# Altium schematic sheet LM61495Q3_PINOUT.SchDoc
size A4; SheetNumber: 6; SheetTotal: 7
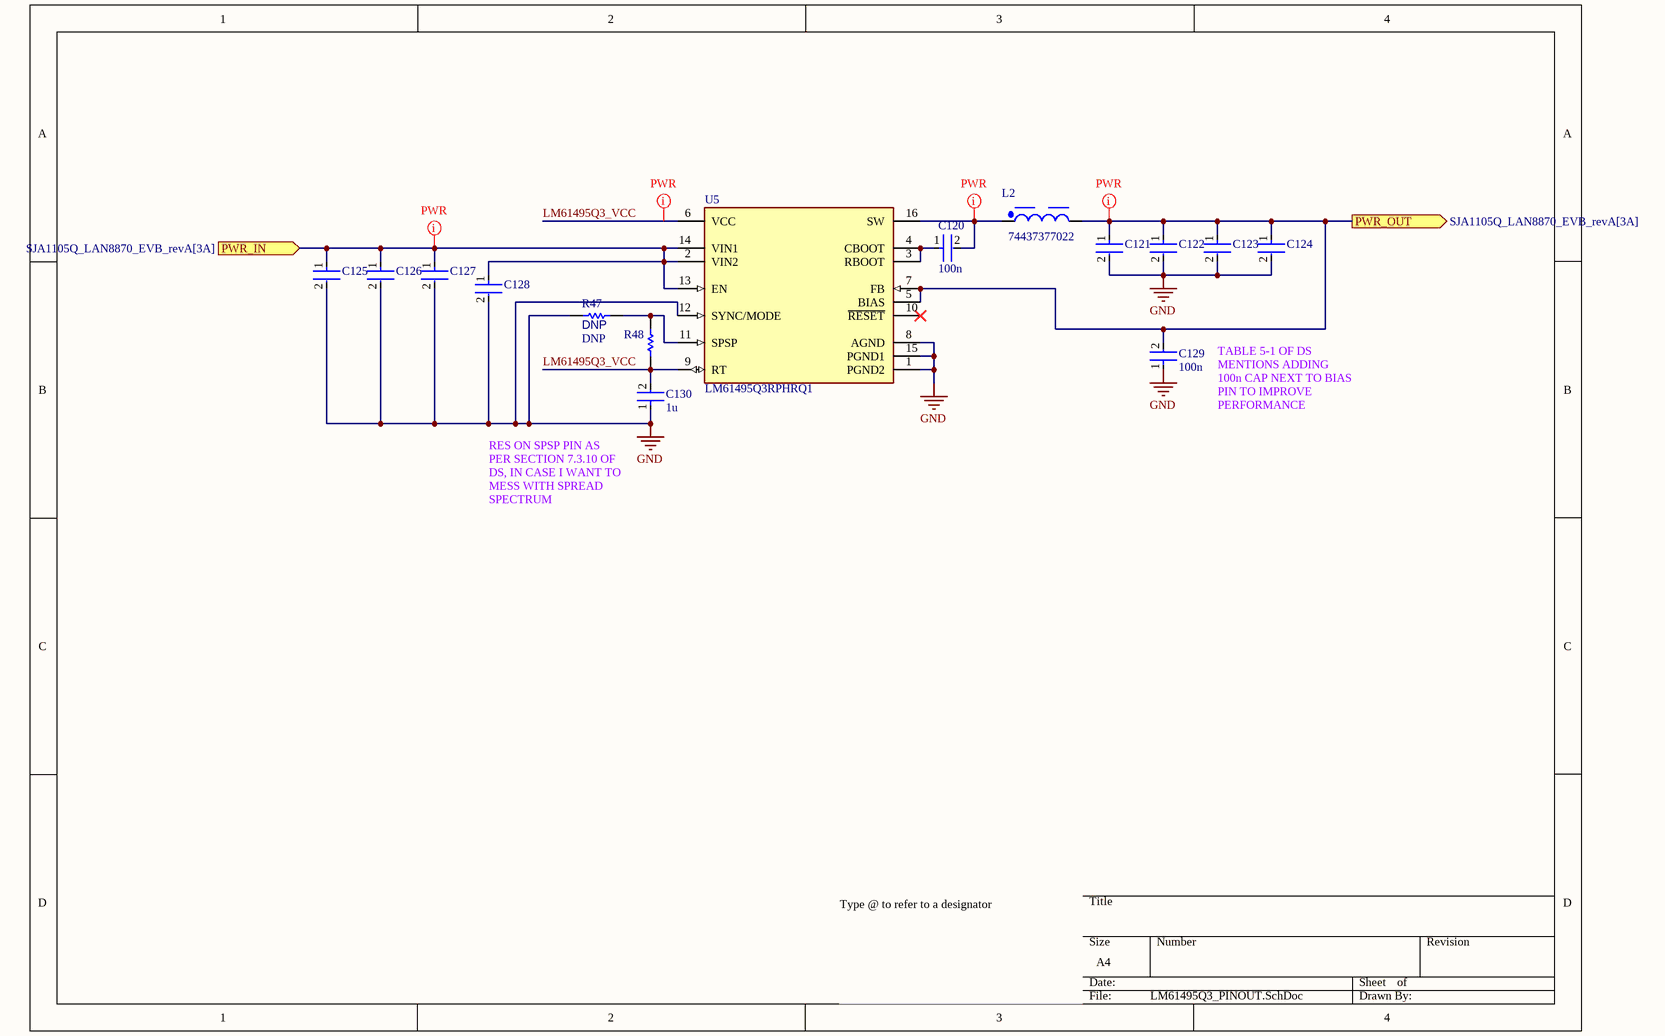
[diagram p0: LM61495Q3_PINOUT.SchDoc]

## Parts
C120  100n  [FP-0402-L_1_0_0_05-W_0_5-IPC_A]
C121  GRM32ER61C476KE15L  [FP-GRM32E-0_3-0_2-IPC_C]  (value not drawn)
C122  GRM32ER61C476KE15L  [FP-GRM32E-0_3-0_2-IPC_C]  (value not drawn)
C123  GRM32ER61C476KE15L  [FP-GRM32E-0_3-0_2-IPC_C]  (value not drawn)
C124  DNP  [FP-GRM32E-0_3-0_2-IPC_C]  (value not drawn)
C125  C3225X7R1H106M250AC  [FP-C3225-250-0_4-MFG]  (value not drawn)
C126  C3225X7R1H106M250AC  [FP-C3225-250-0_4-MFG]  (value not drawn)
C127  08055C474J4Z2A  [FP-0805-L_2_01_0_2-W_1_25-IPC_B]  (value not drawn)
C128  08055C474J4Z2A  [FP-0805-L_2_01_0_2-W_1_25-IPC_B]  (value not drawn)
C129  100n  [FP-0402-L_1_0_0_05-W_0_5-IPC_A]
C130  1u  [FP-0402-L_1_0_0_05-W_0_5-IPC_A]
L2  74437377022  [WE-LHMI_1335]
R47  DNP  [R0603B]
R48  0402 JUMPER  [RESC1005X40X25ML05T05]  (value not drawn)
U5  LM61495Q3RPHRQ1  [FP-RPH0016A-MFG]

## Ports
PWR_IN (in, see SJA1105Q_LAN8870_EVB_revA[3A]), PWR_OUT (out, see SJA1105Q_LAN8870_EVB_revA[3A])

## Nets
GND: C121.2 C122.2 C123.2 C124.2 C125.2 C126.2 C127.2 C128.2 C129.1 C130.1 R47.2 U5.1(PGND2) U5.8(AGND) U5.12(SYNC/MODE) U5.15(PGND1)
LM61495Q3_VCC: C130.2 R48.1 U5.6(VCC) U5.9(RT)
PWR_IN: C125.1 C126.1 C127.1 C128.1 U5.2(VIN2) U5.13(EN) U5.14(VIN1) ; port PWR_IN
PWR_OUT: C121.1 C122.1 C123.1 C124.1 C129.2 L2.2 U5.5(BIAS) U5.7(FB) ; port PWR_OUT
NetC120_1: C120.1 U5.3(RBOOT) U5.4(CBOOT)
NetC120_2: C120.2 L2.1 U5.16(SW)
NetR47_1: R47.1 R48.2 U5.11(SPSP)

Not connected (* = marked no-connect by the designer): U5 10(~{RESET})*

## Layout directives
net class PWR: LM61495Q3_VCC, NetC120_2, PWR_IN, PWR_OUT

## Notes on the sheet
- TABLE 5-1 OF DS MENTIONS ADDING 100n CAP NEXT TO BIAS PIN TO IMPROVE PERFORMANCE
- (near C130) RES ON SPSP PIN AS PER SECTION 7.3.10 OF DS, IN CASE I WANT TO MESS WITH SPREAD SPECTRUM
- Type @ to refer to a designator

## Library data of the parts
C120 C129 C130 = CMP-001-00058-1: LARGE PADS, 0402 CAP, CHANGE COMMENT TO MATCH REAL P/N; Capacitor Type: Ceramic; Min Operating Temperature: -55°C; Mounting Technology: Surface Mount; Pins: 2; Case/Package: 0402; RoHS Compliant: Yes; Max Operating Temperature: 85°C
C121-C124 = CMP-2000-06362-2: CAP CER 47UF 16V X5R 1210; Tolerance: 10%; Material: Ceramic; Case Code (Metric): 3225; RoHS Compliant: Yes; Min Operating Temperature: -55°C; Radiation Hardening: No; Voltage: 16V; Package Quantity: 1; Case Code (Imperial): 1210; REACH SVHC: No SVHC; Capacitance: 47uF; Voltage Rating (DC): 16V; Dielectric: X5R; Case/Package: 1210; Length: 3.2mm; Voltage Rating: 16V; Packaging: Cut Tape; Width: 0.098inch; Number of Pins: 2; Lead Free: Lead Free; Height: 2.5mm; Mount: Surface Mount; Termination: SMD/SMT; Max Operating Temperature: 85°C; Thickness: 0.106inch; Depth: 2.5mm
C125 C126 = CMP-08246-002653-1: Multilayer Ceramic Capacitors 10uF ±20% 50V X7R SMD 1210; Width: 0.098inch; Package Quantity: 1000; Height: 2.5mm; Dielectric Material: Ceramic; Voltage Rating: 50V; Series: C; Capacitance: 10uF; Tolerance: 20%; Weight: 0.000564oz; Case/Package: 1210; Case Code (Imperial): 1210; Dielectric: X7R; Case Code (Metric): 3225; REACH SVHC: No SVHC; Packaging: Tape and Reel; Length: 0.126inch; Termination: SMD/SMT; Min Operating Temperature: -55°C; Voltage Rating (DC): 50V; Lead Free: Lead Free; Max Operating Temperature: 125°C; Thickness: 0.11inch; Mount: Surface Mount
C127 C128 = CMP-04427-003155-1: Automotive Ceramic Capacitor, 0805, 470nF, 5%, X7R, 15%, 50V; Dielectric: X7R; Depth: 1.25mm; Max Operating Temperature: 125°C; Mount: Surface Mount; Radiation Hardening: No; Capacitance: 470nF; Construction: Flat; Packaging: Tape and Reel; Min Operating Temperature: -55°C; Length: 2.01mm; RoHS Compliant: Yes; Voltage Rating (DC): 50V; Case/Package: 0805; Tolerance: 5%; Package Quantity: 2000
L2 = CMP-1353-00019-6: Inductor Power Shielded/Molded Wirewound 2.2uH 20% 100KHz Powdered Iron 10A 0.008Ohm DCR T/R Automotive AEC-Q200; Series Resistance: 8mΩ; DC Resistance (DCR): 7.2mΩ; Inductance: 2.2µH; Saturation Current: 14.2A; Core Material: Composite, Ferrite; Frequency: 22MHz; Mount: Surface Mount; Ambient Temperature Range Low: -40°C; Max DC Current: 10A; Depth: 12.6mm; Height: 3.3mm; Tolerance: 20%; REACH SVHC: Unknown; Width: 12.6mm; Max Operating Temperature: 125°C; Height - Seated (Max): 3.5052mm; Composition: Wirewound; Inductance Tolerance: 20%; Length: 13.5mm; RMS Current (Irms): 10A; Termination: SMD/SMT; Test Frequency: 100kHz; Current Rating: 10A; Case/Package: Nonstandard; Shielding: Shielded; Ambient Temperature Range High: 85°C; Min Operating Temperature: -40°C; Self Resonant Frequency: 22MHz; RoHS: Compliant
R47 = CMP-009-00002-14: Resistor; Value: DNP
R48 = CMP-009-00118-2: READ THE NAME; Pins: 2; Component Type: Standard; Design Item ID: CMP-009-00206-2; Source: 0402jump.SchLib
U5 = CMP-04918-000675-1: 10-A AUTOMOTIVE BUCK CONVERTER O